# Altium schematic sheet Main.SchDoc
size A4; DocumentNumber: 1; SheetNumber: 1
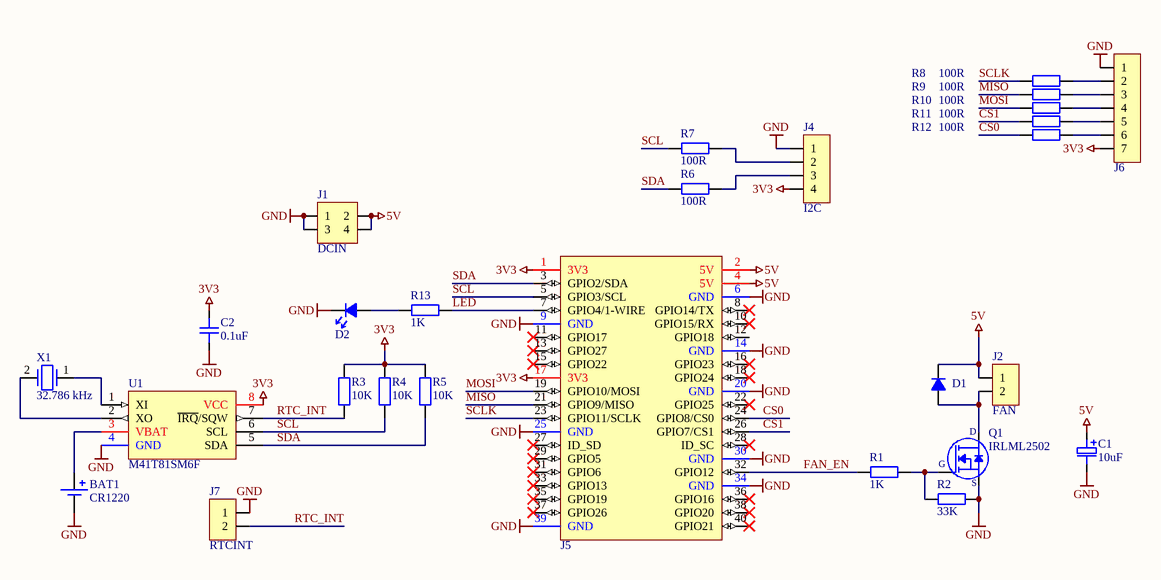
[diagram p0: Main.SchDoc]

## Parts
BAT1  CR1220  [BC501SM]
C1  10uF  [C_EL_B_4MM_RF_M]
C2  0.1uF  [0603C_RF_M]
D1  D  [ONSEMI_DO214AC_RF_M]  (value not drawn)
D2  Unspecified  [0805LED_RF_M]  (value not drawn)
J1  DCIN  [HEADER-2.54-4P-2R]
J2  FAN  [HEADER-2.54-2P1]
J4  I2C  [HEADER-2.54-4P1]
J5  RPI4-40P  [HEADER-2.54-RCPT-40P-2R-BTL]  (value not drawn)
J6  PINHDR-7P1  [HEADER-2.54-7P1]  (value not drawn)
J7  RTCINT  [HEADER-2.54-2P1]
Q1  IRLML2502  [IRLML_SOT-23]
R1  1K  [0603R_RF_M]
R2  33K  [0603R_RF_M]
R3  10K  [0603R_RF_M]
R4  10K  [0603R_RF_M]
R5  10K  [0603R_RF_M]
R6  100R  [0603R_RF_M]
R7  100R  [0603R_RF_M]
R8  100R  [0603R_RF_M]
R9  100R  [0603R_RF_M]
R10  100R  [0603R_RF_M]
R11  100R  [0603R_RF_M]
R12  100R  [0603R_RF_M]
R13  1K  [0603R_RF_M]
U1  M41T81SM6F  [ST_SOIC-8]
X1  32.786 kHz  [XTAL_3215]

## Nets
3V3: C2.2 J4.4 J5.1(3V3) J5.17(3V3) J6.7 R3.2 R4.2 R5.2 U1.8(VCC)
5V: C1.P D1.C J1.2 J1.4 J2.1 J5.2(5V) J5.4(5V)
GND: BAT1.N C1.N C2.1 D2.C J1.1 J1.3 J4.1 J5.6(GND) J5.9(GND) J5.14(GND) J5.20(GND) J5.25(GND) J5.30(GND) J5.34(GND) J5.39(GND) J6.1 J7.1 Q1.2(S) R2.2 U1.4(GND)
CS0: J5.24(GPIO8/CS0) R12.2
CS1: J5.26(GPIO7/CS1) R11.2
FAN_EN: J5.32(GPIO12) R1.1
LED: J5.7(GPIO4/1-WIRE) R13.1
MISO: J5.21(GPIO9/MISO) R9.2
MOSI: J5.19(GPIO10/MOSI) R10.2
RTC_INT: J7.2 R3.1 U1.7(~{IRQ}/SQW)
SCL: J5.5(GPIO3/SCL) R4.1 R7.2 U1.6(SCL)
SCLK: J5.23(GPIO11/SCLK) R8.2
SDA: J5.3(GPIO2/SDA) R5.1 R6.2 U1.5(SDA)
NetBAT1_P: BAT1.P U1.3(VBAT)
NetD1_A: D1.A J2.2 Q1.3(D)
NetD2_A: D2.A R13.2
NetJ4_2: J4.2 R7.1
NetJ4_3: J4.3 R6.1
NetJ6_2: J6.2 R8.1
NetJ6_3: J6.3 R9.1
NetJ6_4: J6.4 R10.1
NetJ6_5: J6.5 R11.1
NetJ6_6: J6.6 R12.1
NetQ1_1: Q1.1(G) R1.2 R2.1
NetU1_1: U1.1(XI) X1.1
NetU1_2: U1.2(XO) X1.2

Not connected (* = marked no-connect by the designer): J5 8(GPIO14/TX)* 10(GPIO15/RX)* 11(GPIO17)* 12(GPIO18) 13(GPIO27)* 15(GPIO22)* 16(GPIO23)* 18(GPIO24)* 22(GPIO25)* 27(ID_SD)* 28(ID_SC)* 29(GPIO5)* 31(GPIO6)* 33(GPIO13)* 35(GPIO19)* 36(GPIO16)* 37(GPIO26)* 38(GPIO20)* 40(GPIO21)*

## Notes on the sheet
- Author
- Date
- Revision
- Size
- A4
- Sheet
- of

## Library data of the parts
BAT1 = BC501SM: Single Cell Battery; Nominal Voltage: 3V; Supplier: DigiKey; Supplier Part No: BC501SM-ND; Supplier Link: https://www.digikey.com/en/products/detail/mpd-memory-protection-devices/BC501SM/2439260; Mounting Technology: SMT; Suitable Battery: CR1220
C1 = C-P: Polarized Capacitor; Manufacturer: Generic Brand; Max Voltage: ? V; Value: 10uF; Mounting Technology: SMT; Tolerance: ?; Tag: *; Manufacturer Part No: *; Supplier: *; Supplier Link: http://; Supplier Part No: *; Category: Capacitor
C2 = C: Capacitor; Manufacturer: Generic Brand; Tolerance: 20%; Max Voltage: 10V; Value: 0.1uF; Mounting Technology: SMT; Tag: *; Manufacturer Part No: *; Supplier: *; Supplier Link: http://; Supplier Part No: *; Category: Capacitor
D1 = D: Diode (Rectifier); Manufacturer: Generic Brand; Max Forward Voltage: ? V; Power Rating: ? W; Manufacturer Part No: *; Supplier: *; Supplier Link: http://; Supplier Part No: *; Mounting Technology: SMT; Category: Diode
D2 = LED: Manufacturer: Generic Brand; Forward Voltage Drop: ? V; Emitting Color: Unspecified; Manufacturer Part No: *; Supplier: *; Supplier Link: http://; Supplier Part No: *; Category: Diode; Mounting Technology: SMT
J1 = PINHDR-4P-2R: Rectangular Header Male Pins Double Row 4 Positions; Mounting Technology: THT
J2 J7 = PINHDR-2P1: Pin Header Single Row 2 Positions; Mounting Technology: THT
J4 = PINHDR-4P1: Generic Pin Header 4x1
J5 = RPI4-40P: Raspberry Pi 4 Model B+ Compatible GPIO Header
J6 = PINHDR-7P1: Pin Header Single Row 7 Positions; Mounting Technology: THT
Q1 = IRLML2502: MOSFET N-CH 20V 4.2A SOT23; Manufacturer: Infineon; Manufacturer Part No: IRLML2502TRPBF; Supplier: DigiKey; Supplier Link: https://www.digikey.com/en/products/detail/infineon-technologies/IRLML2502TRPBF/811439; Supplier Part No: IRLML2502TRPBFCT-ND; Mounting Technology: SMT; Package: SOT-23; Alternative Supplier: Chipdip; Alternative Supplier Part No: 517112745; Alternative Supplier Link: https://www.chipdip.by/product/irlml2502tr
R1-R13 = R: Resistor; Manufacturer: Generic Brand; Power Rating: ? W; Max Voltage: ? V; Tolerance: ?; Supplier Link: http://; Category: Resistor; Mounting Technology: SMT
  R1 R13: Value: 1K
  R2: Value: 33K
  R3-R5: Value: 10K
  R6-R12: Value: 100R
U1 = M41T81SM6F: IC RTC CLK/CALENDAR I2C 8-SOIC; Manufacturer: STMicroelectronics; VCC: 2.7V ~ 5.5V; Detailed Description: Real Time Clock (RTC) IC Clock/Calendar - I²C, 2-Wire Serial 8-SOIC (0.154", 3.90mm Width); Manufacturer Part No: M41T81SM6F; Alternative Supplier: Chipdip; Alternative Supplier Link: https://www.chipdip.by/product/m41t81sm6f; Alternative Supplier Part No: 9000354105; Supplier Part No: 497-4684-1-ND; Supplier: DigiKey; Supplier Link: https://www.digikey.com/en/products/detail/stmicroelectronics/M41T81SM6F/865103; Mounting Technology: SMT; Package: SOIC-8
X1 = XT-2P: Crystal Resonator (2 Leads); Manufacturer: Generic Brand; Tolerance: ? ppm; Mounting Technology: SMT; Supplier Link: http://; Category: Crystal; Value: 32.786 kHz